# EAGLE design facebard-7-sensor-led (EAGLE 9.6.2)
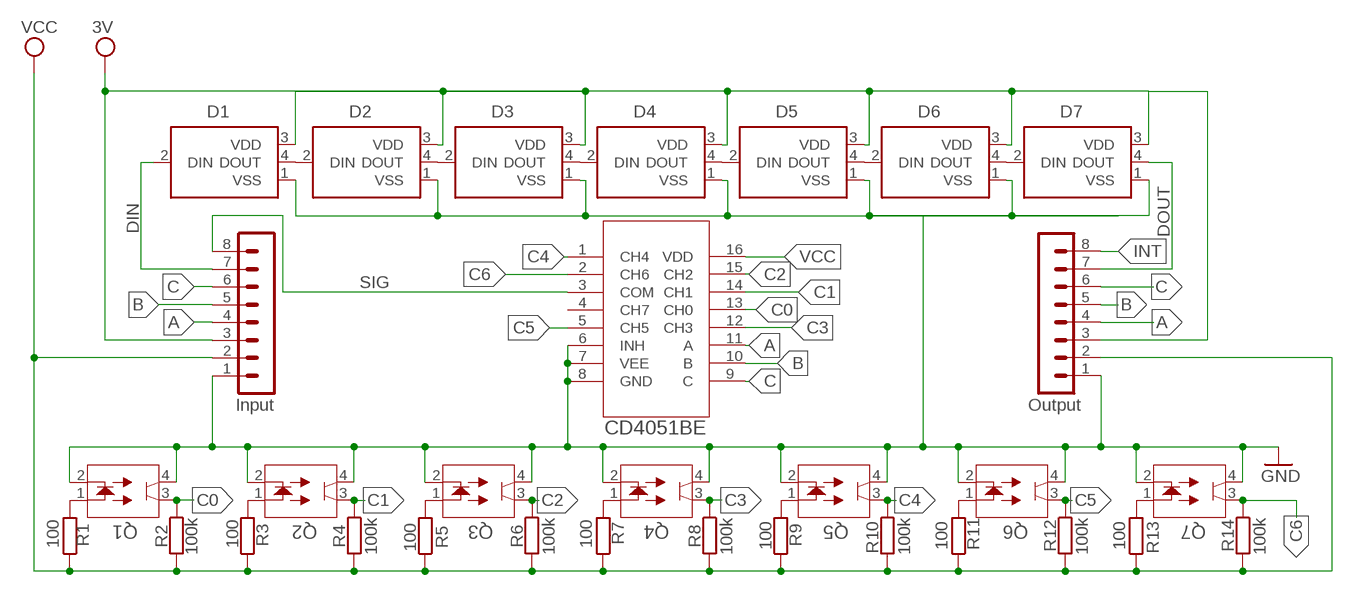
[diagram p0: schematic, sheet 1]

## Parts
D1  1655  [LED_1655]
D2  1655  [LED_1655]
D3  1655  [LED_1655]
D4  1655  [LED_1655]
D5  1655  [LED_1655]
D6  1655  [LED_1655]
D7  1655  [LED_1655]
Q1  QRE1113  [DIP4_100AQ_ONS]
Q2  QRE1113  [DIP4_100AQ_ONS]
Q3  QRE1113  [DIP4_100AQ_ONS]
Q4  QRE1113  [DIP4_100AQ_ONS]
Q5  QRE1113  [DIP4_100AQ_ONS]
Q6  QRE1113  [DIP4_100AQ_ONS]
Q7  QRE1113  [DIP4_100AQ_ONS]
R1  100  R-EU_0207/10  [0207/10]
R2  100k  R-EU_0207/10  [0207/10]
R3  100  R-EU_0207/10  [0207/10]
R4  100k  R-EU_0207/10  [0207/10]
R5  100  R-EU_0207/10  [0207/10]
R6  100k  R-EU_0207/10  [0207/10]
R7  100  R-EU_0207/10  [0207/10]
R8  100k  R-EU_0207/10  [0207/10]
R9  100  R-EU_0207/10  [0207/10]
R10  100k  R-EU_0207/10  [0207/10]
R11  100  R-EU_0207/10  [0207/10]
R12  100k  R-EU_0207/10  [0207/10]
R13  100  R-EU_0207/10  [0207/10]
R14  100k  R-EU_0207/10  [0207/10]
SV2  Output  MA08-1  [MA08-1]
SV3  Input  MA08-1  [MA08-1]
U1  CD4051BE  [N16]

## Nets
3V: D1.3(VDD) D2.3(VDD) D3.3(VDD) D4.3(VDD) D5.3(VDD) D6.3(VDD) D7.3(VDD) SV2.3 SV3.3
A: SV2.4 SV3.4 U1.11(A)
B: SV2.5 SV3.5 U1.10(B)
C: SV2.6 SV3.6 U1.9(C)
C0: Q1.3 R2.1 U1.13(CH0)
C1: Q2.3 R4.1 U1.14(CH1)
C2: Q3.3 R6.1 U1.15(CH2)
C3: Q4.3 R8.1 U1.12(CH3)
C4: Q5.3 R10.1 U1.1(CH4)
C5: Q6.3 R12.1 U1.5(CH5)
C6: Q7.3 R14.1 U1.2(CH6)
DIN: D1.2(DIN) SV3.7
DOUT: D7.4(DOUT) SV2.7
GND: D5.1(VSS) D6.1(VSS) D7.1(VSS) Q1.2 Q1.4 Q2.2 Q2.4 Q3.2 Q3.4 Q4.2 Q4.4 Q5.2 Q5.4 Q6.2 Q6.4 Q7.2 Q7.4 SV2.1 SV3.1 U1.6(INH) U1.7(VEE) U1.8(GND)
INT: SV2.8
N$1: Q1.1 R1.2
N$2: D6.4(DOUT) D7.2(DIN)
N$3: Q2.1 R3.2
N$4: D5.4(DOUT) D6.2(DIN)
N$5: Q3.1 R5.2
N$6: D2.4(DOUT) D3.2(DIN)
N$7: Q4.1 R7.2
N$8: D3.4(DOUT) D4.2(DIN)
N$9: Q5.1 R9.2
N$10: D4.4(DOUT) D5.2(DIN)
N$11: Q6.1 R11.2
N$13: Q7.1 R13.2
N$14: D1.1(VSS) D2.1(VSS) D3.1(VSS)
N$15: D4.1(VSS)
N$29: D1.4(DOUT) D2.2(DIN)
SIG: SV3.8 U1.3(COM)
VCC: R1.1 R2.2 R3.1 R4.2 R5.1 R6.2 R7.1 R8.2 R9.1 R10.2 R11.1 R12.2 R13.1 R14.2 SV2.2 SV3.2 U1.16(VDD)
Unconnected: U1.4(CH7)

## Library data of the parts
D1-D7 = 1655:1655: Ws2812b 5050 Rgb Led With Integrated Driver Chip Pack Of 10; MANUFACTURER: Adafruit Industries; MAXIMUM_PACKAGE_HEIGHT: 1.6 mm; PARTREV: 01; STANDARD: Manufacturer recommendations
Q1-Q7 = qre1113:QRE1113; COPYRIGHT: Copyright (C) 2024 Ultra Librarian. All rights reserved.; MANUFACTURER_PART_NUMBER: QRE1113; MFR_NAME: onsemi
R1-R14 = rcl:R-EU_: RESISTOR, European symbol; SPICEPREFIX: R
SV2 = con-lstb:MA08-1: PIN HEADER; OC_FARNELL: unknown; OC_NEWARK: unknown; SPICEPREFIX: X
SV3 = con-lstb:MA08-1: PIN HEADER; OC_FARNELL: unknown; OC_NEWARK: unknown
U1 = CD4051BE:CD4051BE; COPYRIGHT: Copyright (C) 2024 Ultra Librarian. All rights reserved.; MANUFACTURER_PART_NUMBER: CD4051BE; MFR_NAME: Texas Instruments

## Board
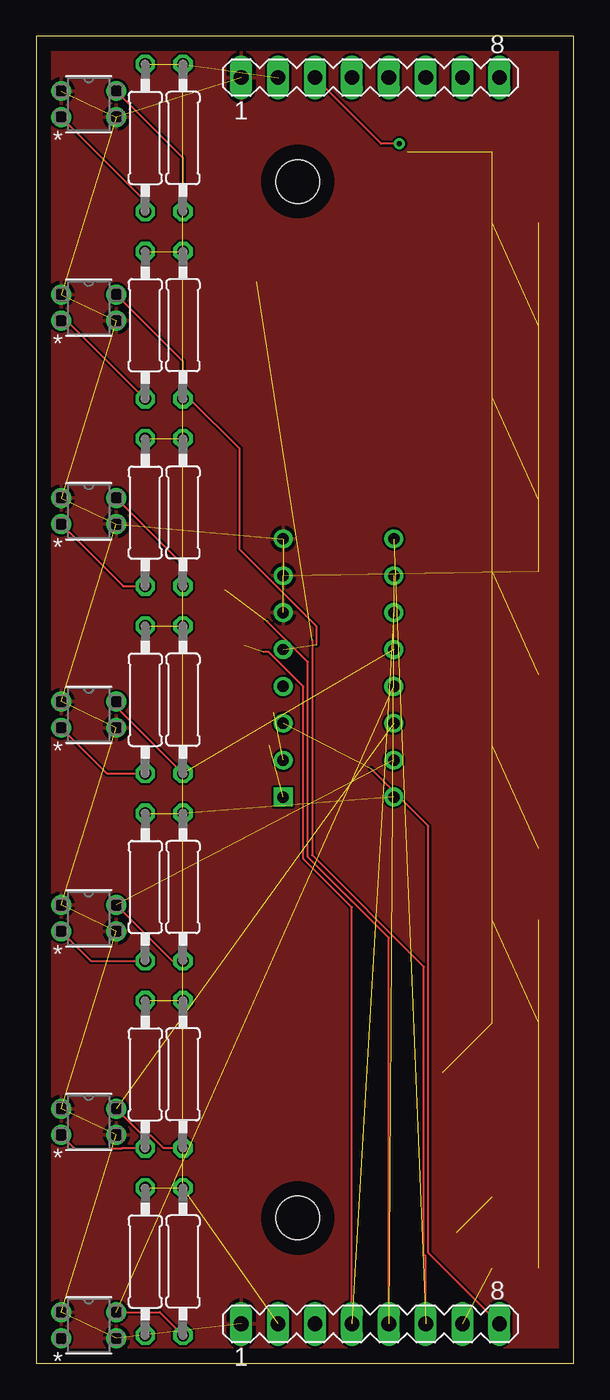
[diagram p1: board, top side]
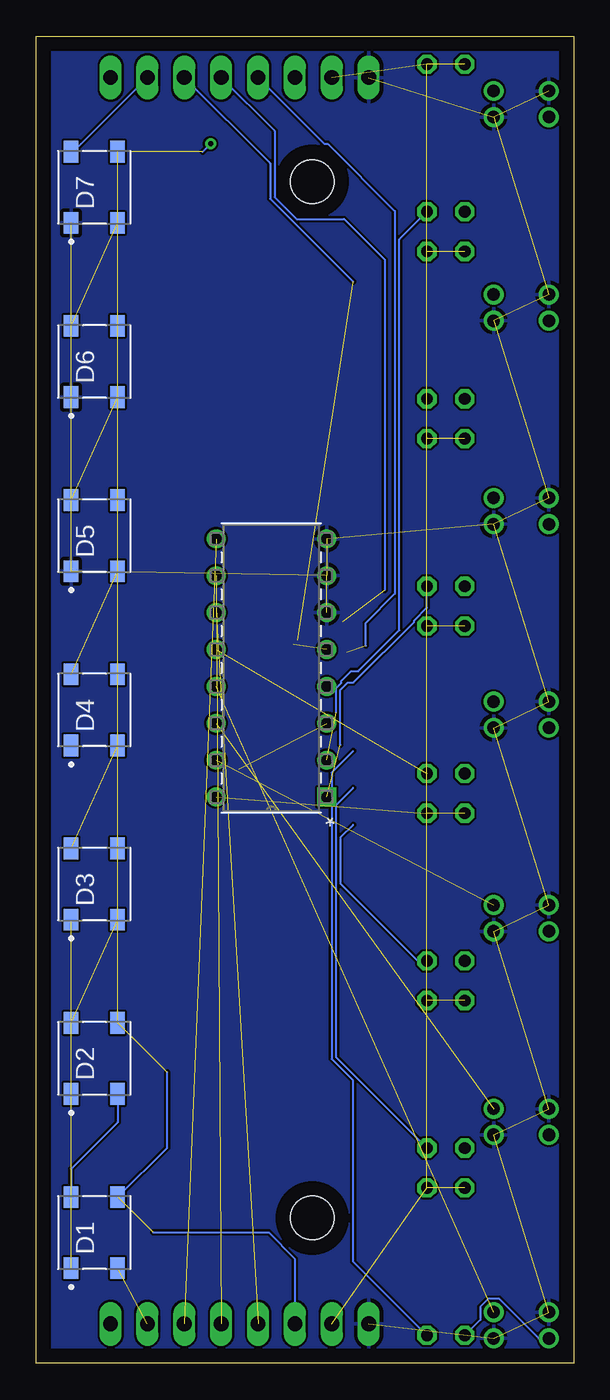
[diagram p2: board, bottom side, seen from below]

Size 37 x 91.4 mm. Coordinates in mm from the lower left corner, seen from the top.
Outline: 0,0 37,0 37,91.4 0,91.4 0,0
Copper layers (1*16): Top 0.035mm / dielectric 1.5mm / Bottom 0.035mm
Design rules "default": minimum track width 6mil, minimum drill 0.35mm, track to track 6mil, track to pad 6mil, pad to pad 6mil, via to via 6mil, smd to smd 6mil, copper to edge 40mil, drill to drill 6mil, minimum pad ring 10mil, minimum via ring 8mil, stop-mask expansion 4mil, vias tented up to drill 0mil, thermal gap 10mil
Holes 3 mm at 18,81.4 18,10

### Footprints (pad centres in the part's own frame; a part is rotated, then mirrored left to right if it is on the bottom)
LED_1655 = smd 1.5 x 1: 1 -2.45,1.6; 2 -2.45,-1.6; 3 2.45,-1.6; 4 2.45,1.6
DIP4_100AQ_ONS = drill 0.864 pad 1.372: 1 0,0; 2 3.81,0; 3 3.81,1.803; 4 0,1.803
0207/10 = drill 0.813 octagon: 1 -5.08,0; 2 5.08,0
MA08-1 = drill 1.016 long: 1 -8.89,0; 2 -6.35,0; 3 -3.81,0; 4 -1.27,0; 5 1.27,0; 6 3.81,0; 7 6.35,0; 8 8.89,0
N16 = drill 0.787 pad 1.295 square: 1 0,0 | drill 0.787 pad 1.295: 2 0,-2.54; 3 0,-5.08; 4 0,-7.62; 5 0,-10.16; 6 0,-12.7; 7 0,-15.24; 8 0,-17.78; 9 7.62,-17.78; 10 7.62,-15.24; 11 7.62,-12.7; 12 7.62,-10.16; 13 7.62,-7.62; 14 7.62,-5.08; 15 7.62,-2.54; 16 7.62,0

### Placement (x,y rotation side)
D1  33,9 90 bottom
D2  33,21 90 bottom
D3  33,33 90 bottom
D4  33,45 90 bottom
D5  33,57 90 bottom
D6  33,69 90 bottom
D7  33,81 90 bottom
Q1  1.71,1.71 0 top
Q2  1.71,15.73 0 top
Q3  1.71,29.75 0 top
Q4  1.71,43.77 0 top
Q5  1.71,57.79 0 top
Q6  1.71,71.81 0 top
Q7  1.71,85.83 0 top
R1  7.5,7 270 top
R2  10.1,7 90 top
R3  7.5,19.9 270 top
R4  10.1,19.9 90 top
R5  7.5,32.8 270 top
R6  10.1,32.8 90 top
R7  7.5,45.7 270 top
R8  10.1,45.7 90 top
R9  7.5,58.6 270 top
R10  10.1,58.6 90 top
R11  7.5,71.5 270 top
R12  10.1,71.5 90 top
R13  7.5,84.4 270 top
R14  10.1,84.4 90 top
SV2  23,88.56 0 top
SV3  23,2.71 0 top
U1  17,39 180 bottom

### Tracks (layer width: path | path; a pad name or v marks a point on that pad's centre or on a via)
3V  (via drill 0.35)  (8 unrouted)
  Top 0.152: v25,84 23.75,84 SV2.3
  Bottom 0.152: 28.95,9 21,9 19.19,7.19 SV3.3 | 25.55,83.45 v25,84 | D1.3 28,14.85 28,20.05
A  (2 unrouted)
  Top 0.152: SV3.4 21.73,31.41 18.39,34.75 18.39,46.61 16,49 15.63,49
  Bottom 0.152: SV2.4 17.16,83.99 16.93,83.99 12.3,79.37 12.3,53 14.3,51 14.3,49.43
B  (2 unrouted)
  Top 0.152: SV3.5 24.27,29.3 18.7,34.87 18.7,48.3 15.91,51.09
  Bottom 0.152: SV2.5 20.59,84.88 20.59,80.33 19.07,78.81 15.81,78.81 13,76 13,53.27
C  (2 unrouted)
  Top 0.152: SV3.6 26.81,7.36 26.7,7.47 26.7,27.3 19,35 19,49.81
  Bottom 0.152: SV2.6 20.9,82.65 20.9,80.2 15.18,74.48
C0  (1 unrouted)
  Top 0.152: Q1.3 8.51,3.51 R2.1
  Bottom 0.152: 15.18,42.17 16.67,40.68 16.67,20.95 15.18,19.47 15.18,7 R2.1
C1  (1 unrouted)
  Top 0.152: Q2.3 7.34,15.71 7.87,15.71 8.76,14.82 R4.1
  Bottom 0.152: 15.18,39.63 16.36,38.45 16.36,21.08 R4.1
C2  (1 unrouted)
  Top 0.152: Q3.3 9.35,27.72 R6.1
  Bottom 0.152: 15.18,37.09 16.06,36.21 16.06,33.06 10.72,27.72 R6.1
C3  (1 unrouted)
  Top 0.152: R8.1 5.51,45.2 Q4.3
  Bottom 0.152: 10.1,40.93 R8.1
C4  (1 unrouted)
  Top 0.152: Q5.3 10.1,55.01 R10.1
  Bottom 0.152: R10.1 10.1,52.04 10.99,51.15 10.99,51.07 15.17,46.89 15.54,46.89 16.06,46.37 16.06,42.59
C5  (1 unrouted)
  Top 0.152: Q6.3 10.1,69.03 R12.1 10.58,66.42 14,63 14,56.05 19.3,50.74 19.3,49.51
C6  (1 unrouted)
  Top 0.152: Q7.3 10.1,83.05 R14.1
  Bottom 0.152: 16.36,44.83 16.36,46.5 16,46.86 16,47 15.33,47.67 14.82,47.67 12,50.49 12,77.42 R14.1
DIN  (1 unrouted)
DOUT
  Bottom 0.152: D7.4 34.46,83.45 SV2.7
GND  (21 unrouted)
  pour Top: 0,91.4 36.9,91.4 37,91.5 37,0 0,0
  pour Bottom: 37,91.4 0.1,91.4 0,91.5 0,0 37,0
N$1
  Bottom 0.152: Q1.1 2.42,1.71 5.14,4.43 5.89,4.43 6.43,3.89 6.43,2.99 R1.2
N$2  (1 unrouted)
N$3
  Top 0.152: R3.2 5.9,14.82 5.89,14.82 2.62,14.82 Q2.1
N$4  (1 unrouted)
N$5
  Top 0.152: Q3.1 3.73,27.72 R5.2
N$6  (1 unrouted)
N$7
  Top 0.152: Q4.1 4.86,40.62 R7.2
N$8  (1 unrouted)
N$9
  Top 0.152: Q5.1 5.97,53.52 R9.2
N$10  (1 unrouted)
N$11
  Top 0.152: Q6.1 2.11,71.81 R11.2
N$13
  Top 0.152: Q7.1 7.5,80.03 R13.2
N$14  (2 unrouted)
N$29
  Bottom 0.152: D2.2 31.4,16.6 34.6,13.4 D1.4
SIG  (1 unrouted)
  Top 0.152: SV3.8 27,7.6 27,37 23.07,40.93
VCC  (16 unrouted)